# EAGLE design tricorder-featherwing-mk-1.3 (EAGLE 7.5.0)
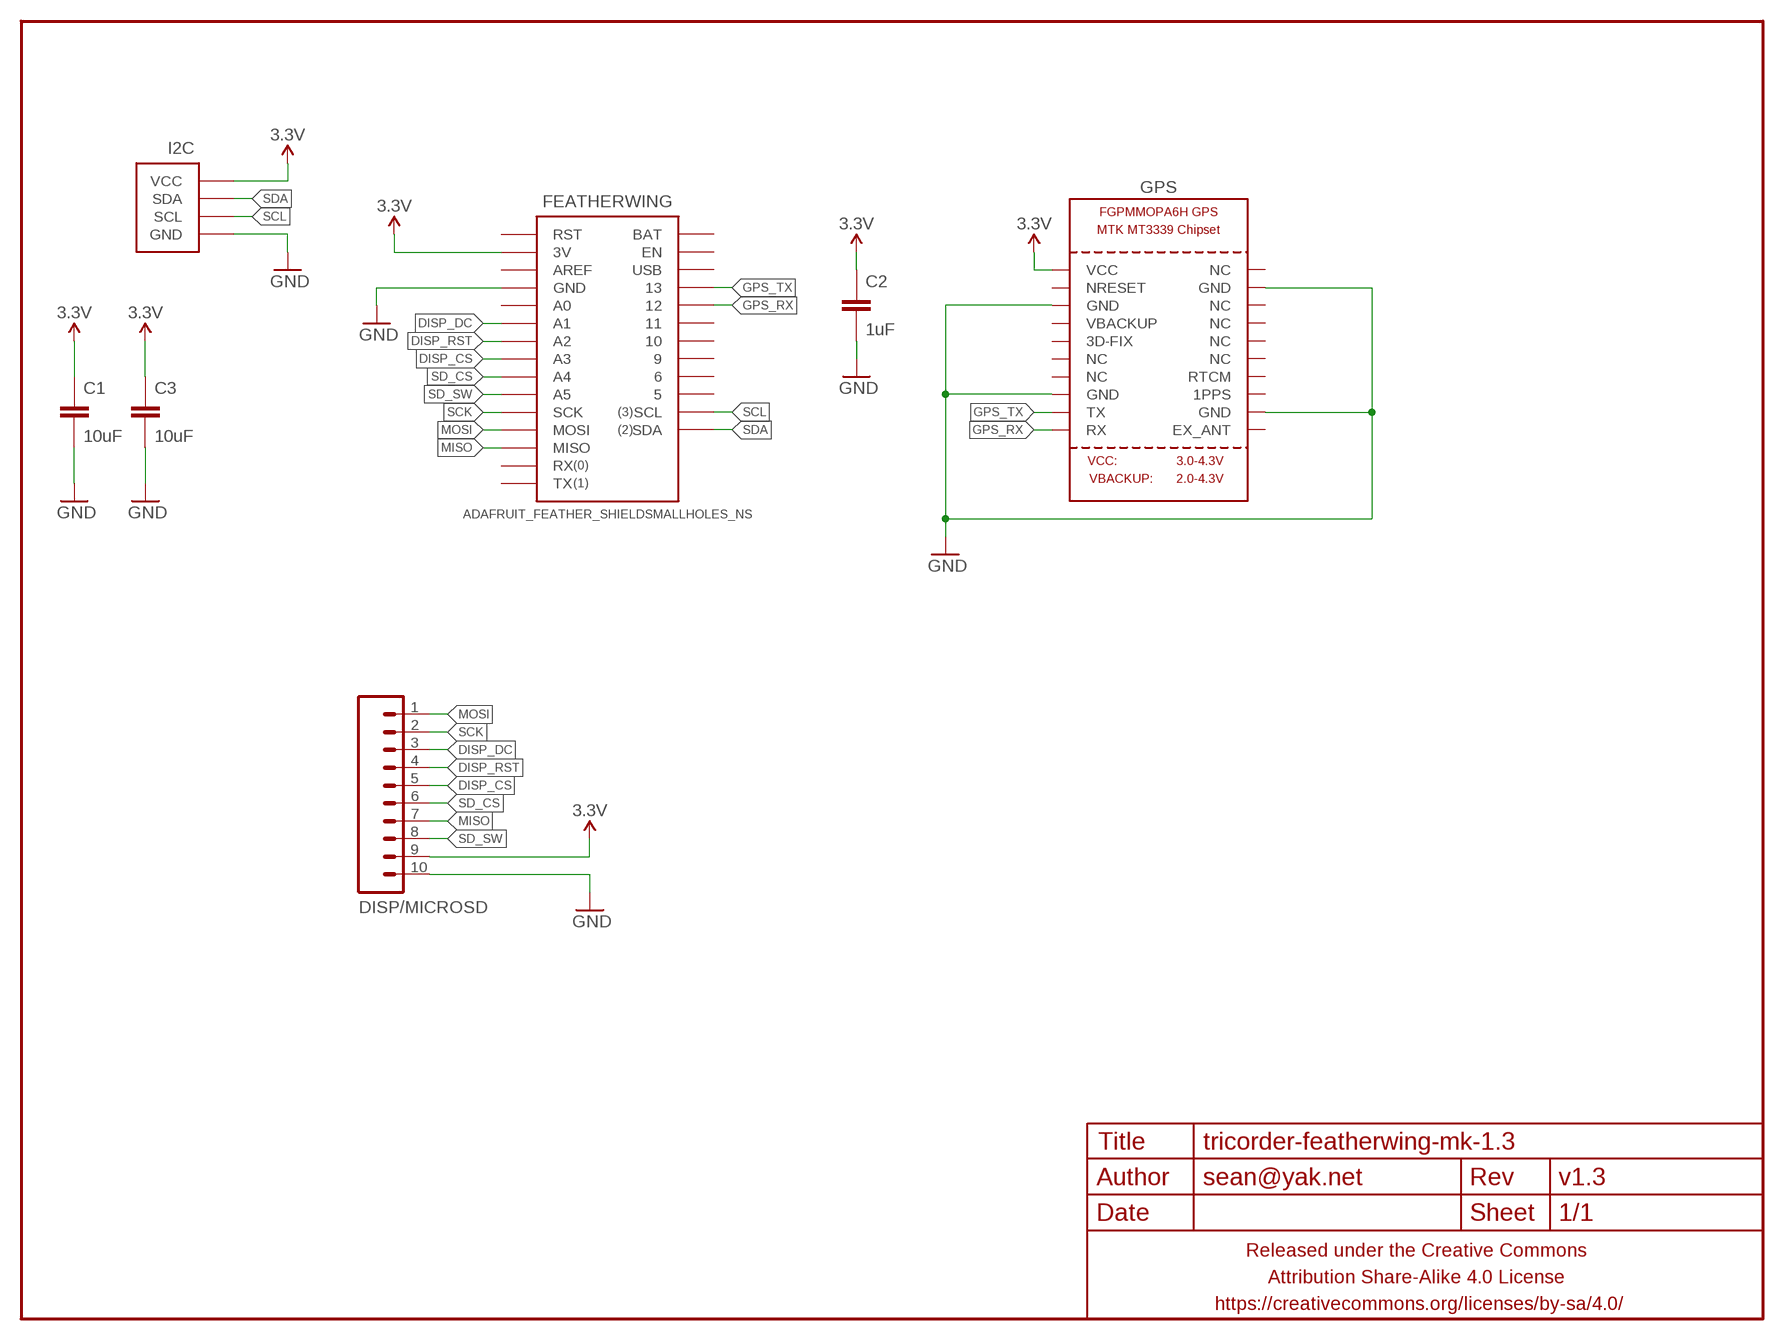
[diagram p0: schematic, sheet 1]

## Parts
C1  10uF  CAPACITOR-CERAMICC1210  [C1210]
C2  1uF  CAPACITOR-CERAMICC0603  [C0603]
C3  10uF  CAPACITOR-CERAMICC1210  [C1210]
DISP/MICROSD  M10JST-10-PH-RA-PTH  [JST-10-PH-RA-PTH]
FEATHERWING  ADAFRUIT_FEATHER_SHIELDSMALLHOLES_NS  [ADAFRUIT_FEATHER_SMALLHOLES_NS]
FRAME1  FRAME-LETTERNO_PACKAGE  [DUMMY]
GPS  GPS_FGPMMOPA6H  [FGPMMOPA6H]
I2C  M04-I2CPTH-0.1IN-CENTERED  [1X04-PTH-VERT-I2C-CENTERED]

## Nets
3.3V: C1.1 C2.1 C3.1 DISP/MICROSD.9 FEATHERWING.3V GPS.P$1(VCC) I2C.VCC
DISP_CS: DISP/MICROSD.5 FEATHERWING.A3
DISP_DC: DISP/MICROSD.3 FEATHERWING.A1
DISP_RST: DISP/MICROSD.4 FEATHERWING.A2
GND: C1.2 C2.2 C3.2 DISP/MICROSD.10 FEATHERWING.GND@0(GND) FEATHERWING.GND@1(GND) GPS.P$3(GND) GPS.P$8(GND) GPS.P$12(GND) GPS.P$19(GND) I2C.GND
GPS_RX: FEATHERWING.12 GPS.P$10(RX)
GPS_TX: FEATHERWING.13 GPS.P$9(TX)
MISO: DISP/MICROSD.7 FEATHERWING.MISO
MOSI: DISP/MICROSD.1 FEATHERWING.MOSI
SCK: DISP/MICROSD.2 FEATHERWING.SCK
SCL: FEATHERWING.SCL I2C.SCL
SD_CS: DISP/MICROSD.6 FEATHERWING.A4
SD_SW: DISP/MICROSD.8 FEATHERWING.A5
SDA: FEATHERWING.SDA I2C.SDA
Unconnected: FEATHERWING.5 FEATHERWING.6 FEATHERWING.9 FEATHERWING.10 FEATHERWING.11 FEATHERWING.A0 FEATHERWING.AREF FEATHERWING.BAT FEATHERWING.EN FEATHERWING.RST FEATHERWING.RX FEATHERWING.TX FEATHERWING.USB GPS.P$2(NRESET) GPS.P$4(VBACKUP) GPS.P$5(3D-FIX) GPS.P$6(NC) GPS.P$7(NC) GPS.P$11(EX_ANT) GPS.P$13(1PPS) GPS.P$14(RTCM) GPS.P$15(NC) GPS.P$16(NC) GPS.P$17(NC) GPS.P$18(NC) GPS.P$20(NC)

## Library data of the parts
C1-C3 = a_parts:CAPACITOR-CERAMIC: CAPACITOR, European symbol
DISP/MICROSD = a_parts:M10: Header 10 Standard 10-pin 0.1" header. Use with straight break away headers (SKU : PRT-00116), right angle break away headers (PRT-00553), swiss pins (PRT-00743), machine pins (PRT-00117), and female headers (PRT-00115).
FEATHERWING = a_parts:ADAFRUIT_FEATHER_SHIELD
FRAME1 = a_parts:FRAME-LETTER: Schematic Frame Standard 8.5x11 US Letter frame; DESIGNER: sean@yak.net; VERSION: v1.3
GPS = a_parts:GPS_FGPMMOPA6H: GPS Module - MTK MT3339 Chipset, -165dBm sensitivity, 22 channels, 10Hz, auto-select external antenna options
I2C = a_parts:M04-I2C

## Board
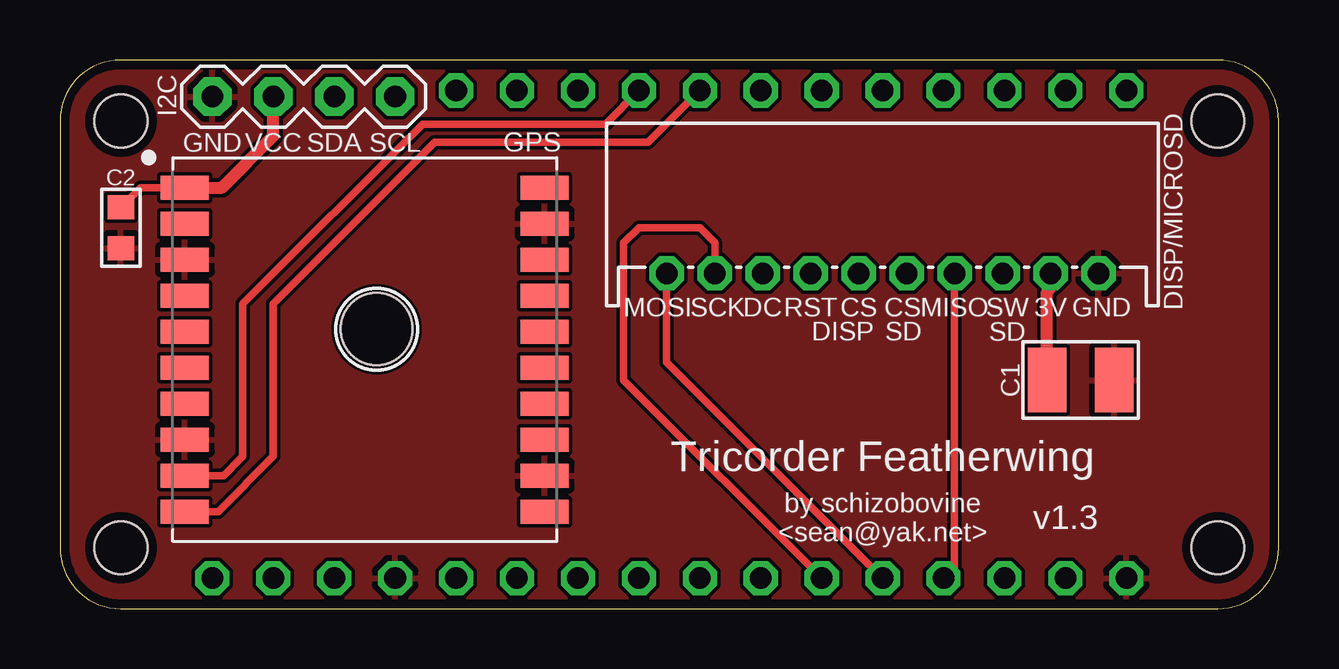
[diagram p1: board, top side]
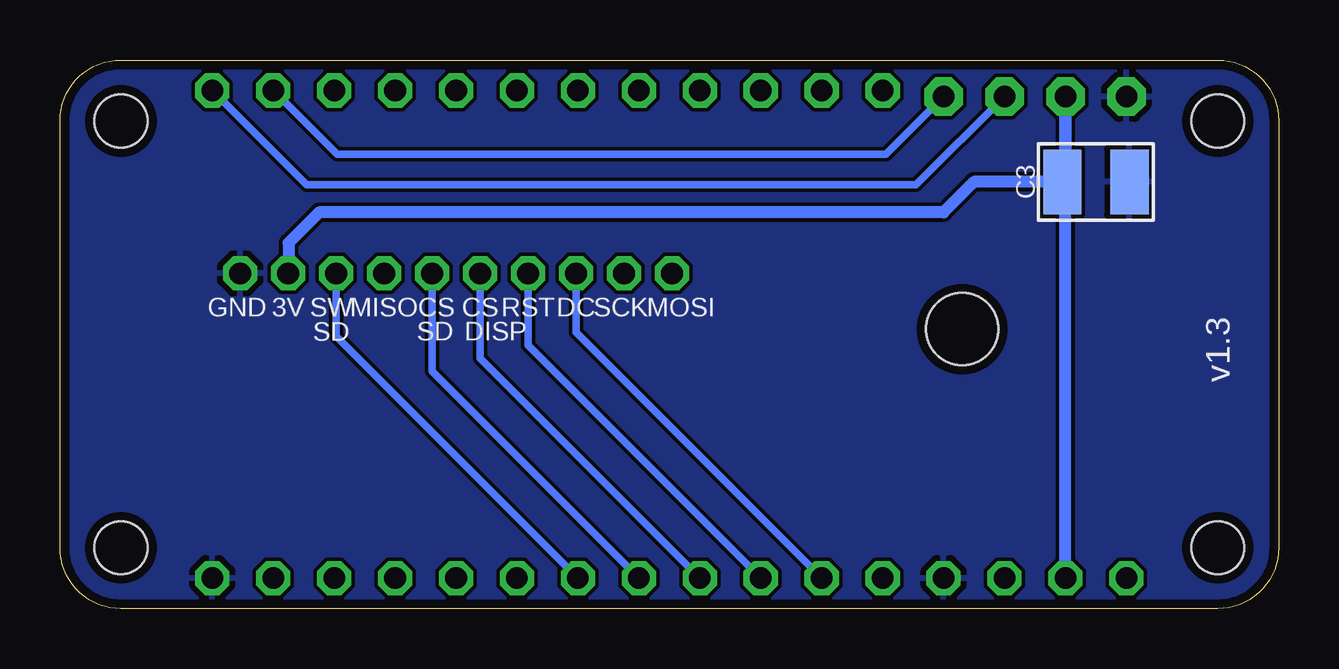
[diagram p2: board, bottom side, seen from below]

Size 50.8 x 22.86 mm. Coordinates in mm from the lower left corner, seen from the top.
Outline: 2.54,0 48.26,0 arc90 50.8,2.54 50.8,20.32 arc90 48.26,22.86 2.54,22.86 arc90 0,20.32 0,2.54 arc90 2.54,0
Copper layers (1*16): Top 0.0356mm / dielectric 1.5011mm / Bottom 0.0356mm
Design rules "LaenPCBOrder2": minimum track width 6mil, minimum drill 13mil, track to track 6mil, track to pad 6mil, pad to pad 6mil, via to via 6mil, smd to smd 6mil, copper to edge 15mil, drill to drill 6mil, minimum pad ring 7mil, minimum via ring 7mil, stop-mask expansion 3mil, vias tented up to drill 20mil, thermal gap 10mil
Holes 2.2 mm at 2.54,2.54 48.26,2.54 48.26,20.32 2.54,20.32

### Footprints (pad centres in the part's own frame; a part is rotated, then mirrored left to right if it is on the bottom)
C1210 = smd 1.6 x 2.7: 1 -1.4,0; 2 1.4,0
C0603 = smd 1 x 1.1: 1 -0.85,0; 2 0.85,0
JST-10-PH-RA-PTH = drill 0.9 pad 1.422 octagon: 1 -9,0; 2 -7,0; 3 -5,0; 4 -3,0; 5 -1,0; 6 1,0; 7 3,0; 8 5,0; 9 7,0; 10 9,0
ADAFRUIT_FEATHER_SMALLHOLES_NS = drill 0.9 pad 1.422 octagon: 3V -16.51,-10.16; 5 13.97,10.16; 6 11.43,10.16; 9 8.89,10.16; 10 6.35,10.16; 11 3.81,10.16; 12 1.27,10.16; 13 -1.27,10.16; A0 -8.89,-10.16; A1 -6.35,-10.16; A2 -3.81,-10.16; A3 -1.27,-10.16; A4 1.27,-10.16; A5 3.81,-10.16; AREF -13.97,-10.16; BAT -8.89,10.16; EN -6.35,10.16; GND@0 -11.43,-10.16; GND@1 19.05,-10.16; MISO 11.43,-10.16; MOSI 8.89,-10.16; RST -19.05,-10.16; RX 13.97,-10.16; SCK 6.35,-10.16; SCL 16.51,10.16; SDA 19.05,10.16; TX 16.51,-10.16; USB -3.81,10.16
FGPMMOPA6H = smd 2 x 1: P$1 -7.5,6.75; P$2 -7.5,5.25; P$3 -7.5,3.75; P$4 -7.5,2.25; P$5 -7.5,0.75; P$6 -7.5,-0.75; P$7 -7.5,-2.25; P$8 -7.5,-3.75; P$9 -7.5,-5.25; P$10 -7.5,-6.75; P$11 7.5,-6.75; P$12 7.5,-5.25; P$13 7.5,-3.75; P$14 7.5,-2.25; P$15 7.5,-0.75; P$16 7.5,0.75; P$17 7.5,2.25; P$18 7.5,3.75; P$19 7.5,5.25; P$20 7.5,6.75 | hole 3: 0.5,0.85
1X04-PTH-VERT-I2C-CENTERED = drill 0.9 pad 1.6 octagon: GND -3.81,0; SCL 3.81,0; SDA 1.27,0; VCC -1.27,0

### Placement (x,y rotation side)
C1  42.55,9.53 0 top
C2  2.54,15.88 270 top
C3  7.62,17.78 0 bottom
DISP/MICROSD  34.29,13.97 0 top
FEATHERWING  25.4,11.43 0 top
FRAME1  0,0 0 top
GPS  12.7,10.79 0 top
I2C  10.16,21.34 0 top

### Tracks (layer width: path | path; a pad name or v marks a point on that pad's centre or on a via)
3.3V
  Top 0.305: GPS.P$1 3.36,17.55 C2.1
  Top 0.508: GPS.P$1 6.75,17.55 8.89,19.68 I2C.VCC | C1.1 41.15,13.21 41.27,13.34 41.27,13.96 DISP/MICROSD.9
  Bottom 0.508: FEATHERWING.3V I2C.VCC 8.89,17.91 C3.1 12.7,17.78 13.97,16.51 40.01,16.51 41.27,15.24 41.27,13.98 DISP/MICROSD.9
DISP_CS
  Bottom 0.305: DISP/MICROSD.5 33.29,10.43 FEATHERWING.A3
DISP_DC
  Bottom 0.305: DISP/MICROSD.3 29.29,11.51 FEATHERWING.A1
DISP_RST
  Bottom 0.305: DISP/MICROSD.4 31.29,10.97 FEATHERWING.A2
GND
  pour Bottom: 2.54,0 48.26,0 arc90 50.8,2.54 50.8,20.32 arc90 48.26,22.86 2.54,22.86 arc90 0,20.32 0,2.54 arc90
  pour Top: 2.54,0 48.26,0 arc90 50.8,2.54 50.8,20.32 arc90 48.26,22.86 2.54,22.86 arc90 0,20.32 0,2.54 arc90
GPS_RX
  Top 0.305: FEATHERWING.12 24.51,19.43 15.62,19.43 8.89,12.7 8.89,6.35 6.58,4.04 GPS.P$10
GPS_TX
  Top 0.305: FEATHERWING.13 22.73,20.19 15.11,20.19 7.62,12.7 7.62,6.35 7.56,6.29 6.82,5.54 GPS.P$9
MISO
  Top 0.305: DISP/MICROSD.7 37.29,1.73 FEATHERWING.MISO
MOSI
  Top 0.305: DISP/MICROSD.1 25.29,10.27 FEATHERWING.MOSI
SCK
  Top 0.305: DISP/MICROSD.2 27.29,13.98 27.3,15.24 26.67,15.88 24.13,15.88 23.5,15.24 23.5,9.53 FEATHERWING.SCK
SCL
  Bottom 0.305: FEATHERWING.SCL 39.24,18.92 16.38,18.92 I2C.SCL
SD_CS
  Bottom 0.305: DISP/MICROSD.6 35.29,9.89 FEATHERWING.A4
SD_SW
  Bottom 0.305: DISP/MICROSD.8 39.29,11.35 FEATHERWING.A5
SDA
  Bottom 0.305: FEATHERWING.SDA 40.51,17.65 15.11,17.65 I2C.SDA

### Text on the board
tPlace: MOSI | SCK | DC | RST | CS | CS | MISO | SW | 3V | GND | DISP | SD | SD | Tricorder Featherwing | by schizobovine / <sean@yak.net>
bPlace: MOSI | SCK | DC | RST | CS | CS | MISO | SW | 3V | GND | DISP | SD | SD